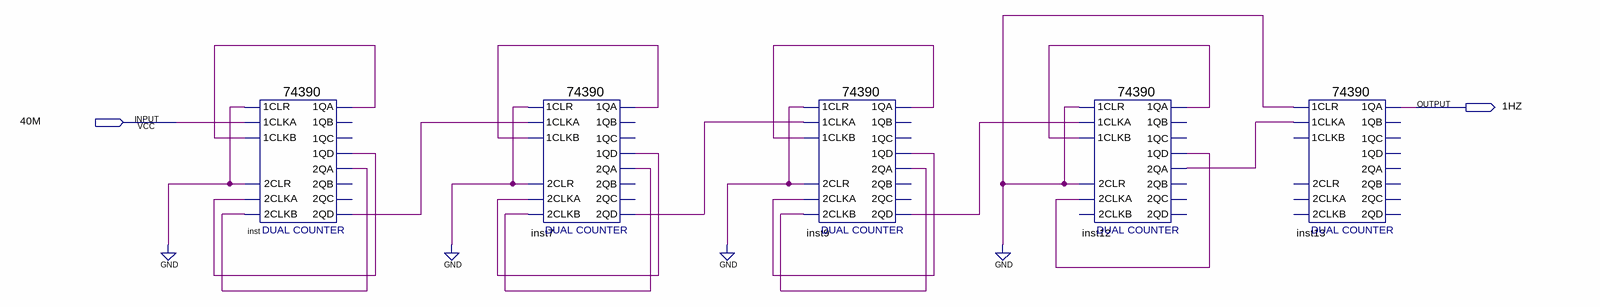
[diagram p0: schematic sheet]
// Quartus schematic 40M.bdf as structural Verilog: 5 symbols, 2 pins
module \40M  (
  input  \40M ,
  output \1HZ 
);

  wire inst7_1qa, inst7_1qd, inst7_2qa, inst7_2qd, inst9_1qa, inst9_1qd, inst9_2qa, inst9_2qd, inst12_1qa,
       inst12_1qd, inst12_2qa, inst_1qa, inst_1qd, inst_2qa, inst_2qd;

  \74390  inst (
    .\2CLKA (inst_1qd), .\2CLR (1'b0), .\2CLKB (inst_2qa), .\1CLR (1'b0), .\1CLKA (\40M ),
    .\1CLKB (inst_1qa), .\1QA (inst_1qa), .\1QD (inst_1qd), .\2QA (inst_2qa), .\2QD (inst_2qd));  // open: 1QB, 1QC, 2QB, 2QC
  \74390  inst7 (
    .\2CLKA (inst7_1qd), .\2CLR (1'b0), .\2CLKB (inst7_2qa), .\1CLR (1'b0), .\1CLKA (inst_2qd),
    .\1CLKB (inst7_1qa), .\1QA (inst7_1qa), .\1QD (inst7_1qd), .\2QA (inst7_2qa), .\2QD (inst7_2qd));  // open: 1QB, 1QC, 2QB, 2QC
  \74390  inst9 (
    .\2CLKA (inst9_1qd), .\2CLR (1'b0), .\2CLKB (inst9_2qa), .\1CLR (1'b0), .\1CLKA (inst7_2qd),
    .\1CLKB (inst9_1qa), .\1QA (inst9_1qa), .\1QD (inst9_1qd), .\2QA (inst9_2qa), .\2QD (inst9_2qd));  // open: 1QB, 1QC, 2QB, 2QC
  \74390  inst12 (
    .\2CLKA (inst12_1qd), .\2CLR (1'b0), .\1CLR (1'b0), .\1CLKA (inst9_2qd), .\1CLKB (inst12_1qa),
    .\1QA (inst12_1qa), .\1QD (inst12_1qd), .\2QA (inst12_2qa));  // open: 2CLKB, 1QB, 1QC, 2QB, 2QC, 2QD
  \74390  inst13 (
    .\1CLR (1'b0), .\1CLKA (inst12_2qa), .\1QA (\1HZ ));  // open: 2CLKA, 2CLR, 2CLKB, 1CLKB, 1QB, 1QC, 1QD, 2QA, 2QB, 2QC, 2QD
endmodule
